# Altium schematic sheet 03_Mini_USB_Circuit.SchDoc
size A; SheetNumber: 4; SheetTotal: 8
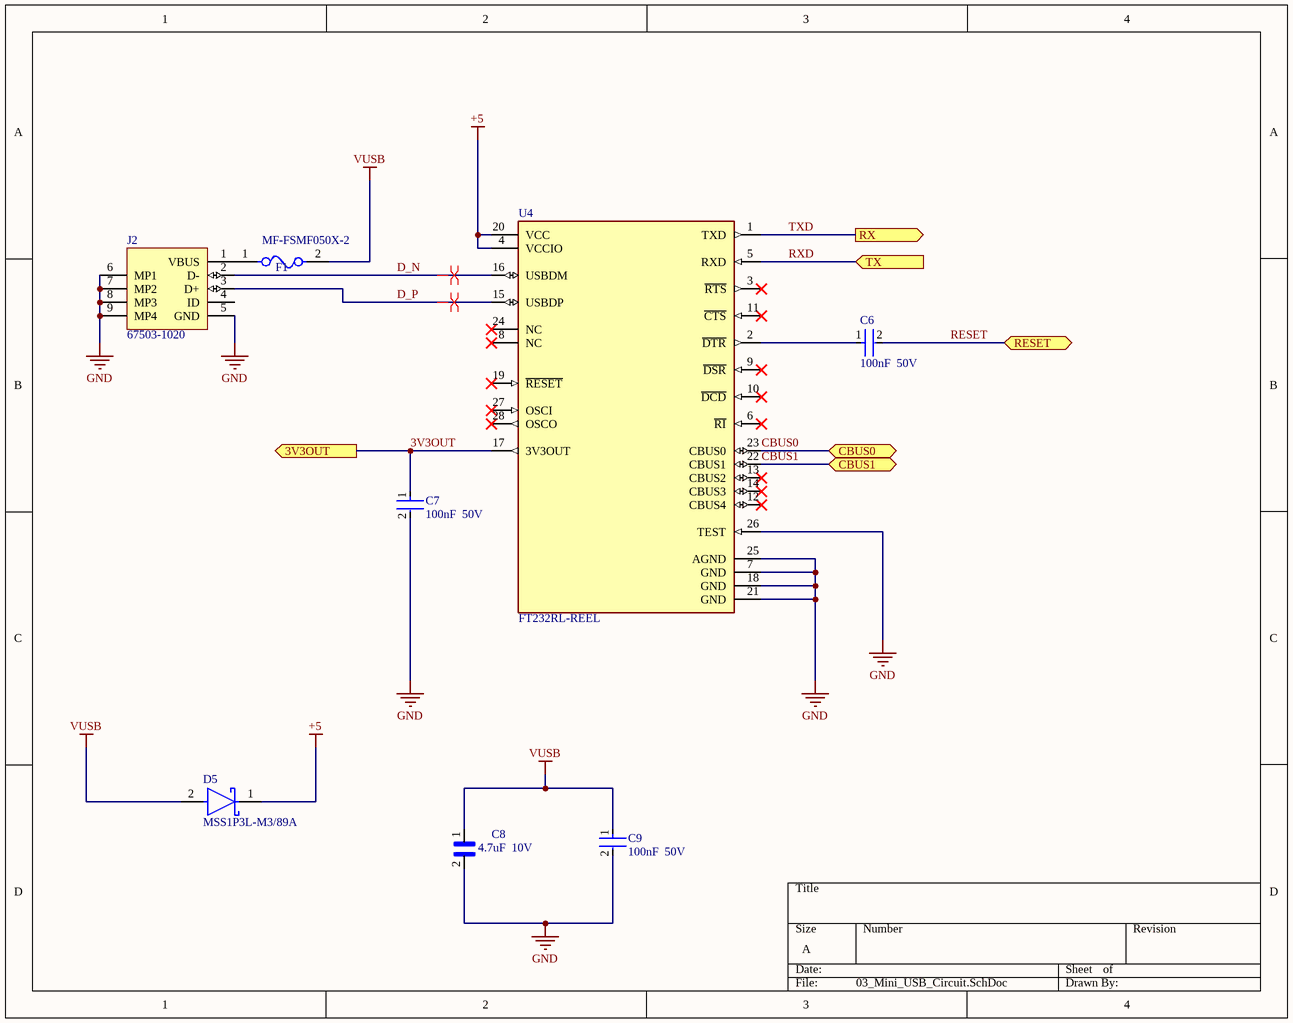
[diagram p0: 03_Mini_USB_Circuit.SchDoc]

## Parts
C6  100nF  50V  [FP-0805-L_2_01_0_2-W_1_25-IPC_C]
C7  100nF  50V  [FP-0805-L_2_01_0_2-W_1_25-IPC_C]
C8  4.7uF  10V  [CAPC1608X90]
C9  100nF  50V  [FP-0805-L_2_01_0_2-W_1_25-IPC_C]
D5  MSS1P3L-M3/89A  [FP-96591-MFG]
F1  MF-FSMF050X-2  [FP-MF-FSMF-MFG]
J2  67503-1020  [MOLX-67503-1020_V]
U4  FT232RL-REEL  [FP-SSOP-28-MFG]

## Ports
3V3OUT (out, see 00_Overview[4B], 04_Pin_Headers[3C]), CBUS0 (bidir, see 00_Overview[3B], 01_Microcontroller_Circuit[2C]), CBUS1 (bidir, see 00_Overview[3B], 01_Microcontroller_Circuit[2D]), RESET (bidir, see 00_Overview[3B], 01_Microcontroller_Circuit[3B], 04_Pin_Headers[1A]), RX (out, see 00_Overview[3B], 01_Microcontroller_Circuit[4A]), TX (in, see 00_Overview[3B], 01_Microcontroller_Circuit[4B])

## Nets
+5: D5.1(C) U4.4(VCCIO) U4.20(VCC)
GND: C7.2 C8.2 C9.2 J2.5(GND) J2.6(MP1) J2.7(MP2) J2.8(MP3) J2.9(MP4) U4.7(GND) U4.18(GND) U4.21(GND) U4.25(AGND) U4.26(TEST)
VUSB: C8.1 C9.1 D5.2(A) F1.2
3V3OUT: C7.1 U4.17(3V3OUT) ; port 3V3OUT
CBUS0: U4.23(CBUS0) ; port CBUS0
CBUS1: U4.22(CBUS1) ; port CBUS1
D_N: J2.2(D-) U4.16(USBDM)
D_P: J2.3(D+) U4.15(USBDP)
RESET: C6.2 ; port RESET
RXD: U4.5(RXD) ; port TX
TXD: U4.1(TXD) ; port RX
NetC6_1: C6.1 U4.2(~{DTR})
NetF1_1: F1.1 J2.1(VBUS)

Not connected (* = marked no-connect by the designer): J2 4(ID); U4 3(~{RTS})* 6(~{RI})* 8(NC)* 9(~{DSR})* 10(~{DCD})* 11(~{CTS})* 12(CBUS4)* 13(CBUS2)* 14(CBUS3)* 19(~{RESET})* 24(NC)* 27(OSCI)* 28(OSCO)*

## Layout directives
differential pair: D_N, D_P

## Library data of the parts
C6 C7 C9 = CMP-2000-05016-2: General Purpose Ceramic Capacitor, 0805, 100nF, 10%, X7R, 0.15, 50V; Dissipation Factor: 2.5%; Insulation Resistance: 100GR; Voltage Rating (DC): 50V; Package Quantity: 4000; Tolerance: 10%; Voltage Rating: 50V; Dielectric: X7R; Case/Package: 0805; Lead Free: Lead Free; Dielectric Material: Ceramic; Thickness: 0.037inch; Weight: 0.001411oz; Max Operating Temperature: 125°C; REACH SVHC: No SVHC; Mount: Surface Mount; RoHS Compliant: Yes; Depth: 1.25mm; Height: 0.5mm; Case Code (Metric): 2012; Length: 2mm; Termination: Standard; Case Code (Imperial): 0805; Number of Pins: 2; Voltage: 50V; Radiation Hardening: No; Min Operating Temperature: -55°C; Capacitance: 100nF; Width: 1.2mm; Series: MLCC X7R; Packaging: Cut Tape
C8 = CC0603ZRY5V5BB475: SnapEDA_Link: https://www.snapeda.com/parts/CC0603ZRY5V5BB475/Yageo/view-part/?ref=snap; Check_prices: https://www.snapeda.com/parts/CC0603ZRY5V5BB475/Yageo/view-part/?ref=eda; Value: *
D5 = CMP-02539-000006-1: DIODE SCHOTTKY 30V 1A MICROSMP; Manufacturer: Vishay; Max Junction Temp: +150°C; Max Surge Forward Current: 25A; Value: 65pF; Peak Reverse Current: 15uA; Max Repetitive Reverse Voltage: 30V; Mouser Description: Schottky Diodes & Rectifiers 1.0 Amp 30 Volt; Device Class L2: Diodes; RoHS: TRUE; Temperature Range Low: -55°C; ComponentLink2URL: http://www.vishay.com/docs/89020/mss1p3l.pdf; Octopart: https://octopart.com/mss1p3l-m3%2F89a-vishay-42670898; Automotive: No; Height: 0.73mm; Temperature: -55°C to +150°C; Temperature Range High: +150°C; ComponentLink2Description: Datasheet; Lead Free: Yes; Digikey Description: DIODE SCHOTTKY 30V 1A MICROSMP; Forward Current: 1A; Manufacturer Part Number: MSS1P3L-M3/89A; Footprint Url: http://www.vishay.com/docs/96591/microsmp_do-219ad_fredpt.pdf; Device Class L1: Discrete Semiconductors; Capacitance: 65pF; Device Class L3: Schottky Diodes; Package: 96591; Category: Diode
F1 = CMP-07400-000010-1: PTC RESET FUSE 6V 500MA 0603; Manufacturer: Bourns Inc.; Trip Current: 1A; Current Rating: 40A; Hold Current: 0.5A; Resistance: 0.1-0.8Ω; Value: 0.1-0.8Ω; Trip Time: 0.1s; Mouser Description: Resettable Fuses - PPTC 6volts 40amps; Category: Fuse; Digikey Description: PTC RESET FUSE 6V 500MA 0603; Temperature: -40°C to +85°C; Device Class L3: unset; Automotive: No; RoHS: TRUE; Ambient Temperature Range High: +85°C; Device Class L2: PTC Resettable Fuses; Temperature Range High: +85°C; Voltage Rating: 6V; Package: MF-FSMF; Manufacturer Part Number: MF-FSMF050X-2; Ambient Temperature Range Low: -40°C; Lead Free: Yes; ComponentLink2Description: Datasheet; Octopart: https://octopart.com/mf-fsmf050x-2-bourns-10470804; ComponentLink2URL: https://www.bourns.com/docs/Product-Datasheets/mffsmf.pdf; Temperature Range Low: -40°C; Height: 1mm; Device Class L1: Circuit Protection
J2 = CMP-0411-00002-1: USB, MINI, SMD, RA KME04-USBMU03A01; Manufacturer: Molex; ComponentLink1URL: http://www.molex.com/; PartNumber: 67503-1020; Mounting Technology: Surface Mount; ComponentLink1Description: Manufacturer URL; Terminal Pitch: 0.8 mm; DatasheetVersion: Rev F, 06/2009; ComponentLink2Description: Datasheet; PackageDescription: Mini USB Connector, SMT, Righer Angle; ComponentLink2URL: http://www.molex.com/pdm_docs/sd/675031020_sd.pdf; PackageReference: 67503-1020
U4 = CMP-0078-00029-4: IC USB FS SERIAL UART 28-SSOP; Data Rate: 12Mbps; Max Supply Voltage: 5.25V; Operating Supply Current: 15mA; Number of Channels: 1; Voltage: 5V; Min Supply Voltage: 3.3V; Radiation Hardening: No; Mount: Surface Mount; Min Operating Temperature: -40°C; Package Quantity: 2000; Number of Transceivers: 1; Width: 5.3mm; Number of Pins: 28; Height: 1.75mm; Weight: 0.080001oz; Lead Free: Lead Free; Length: 10.2mm; REACH SVHC: No SVHC; Max Operating Temperature: 85°C; Packaging: Tape and Reel; Interface: UART; Case/Package: SSOP